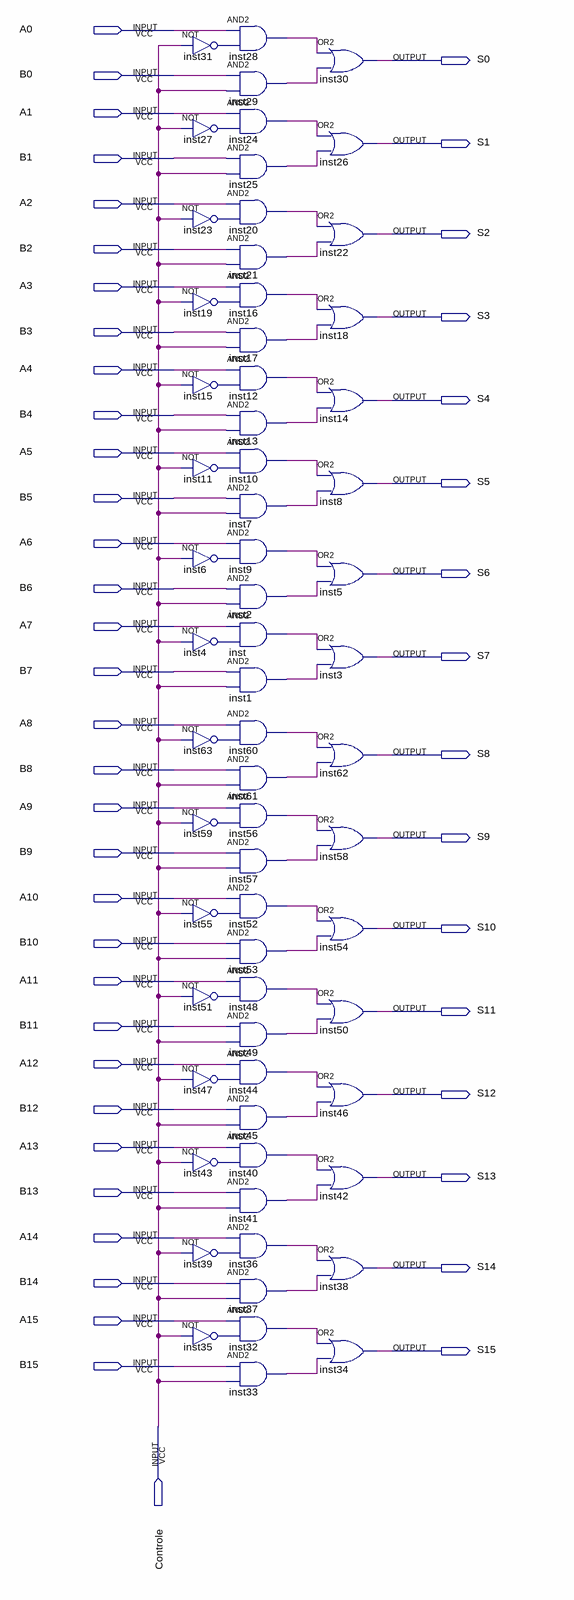
[diagram p0: schematic sheet]
// Quartus schematic Mux32X16.bdf as structural Verilog: 64 symbols, 49 pins
module Mux32X16 (
  input  A0,
  input  B0,
  input  A1,
  input  B1,
  input  A2,
  input  B2,
  input  A3,
  input  B3,
  input  A4,
  input  B4,
  input  A5,
  input  B5,
  input  A6,
  input  B6,
  input  A7,
  input  B7,
  input  A8,
  input  B8,
  input  A9,
  input  B9,
  input  A10,
  input  B10,
  input  A11,
  input  B11,
  input  A12,
  input  B12,
  input  A13,
  input  B13,
  input  A14,
  input  B14,
  input  A15,
  input  B15,
  input  Controle,
  output S0,
  output S1,
  output S2,
  output S3,
  output S4,
  output S5,
  output S6,
  output S7,
  output S8,
  output S9,
  output S10,
  output S11,
  output S12,
  output S13,
  output S14,
  output S15
);

  wire inst1_out, inst2_out, inst4_out, inst6_out, inst7_out, inst9_out, inst10_out, inst11_out, inst12_out,
       inst13_out, inst15_out, inst16_out, inst17_out, inst19_out, inst20_out, inst21_out, inst23_out,
       inst24_out, inst25_out, inst27_out, inst28_out, inst29_out, inst31_out, inst32_out, inst33_out,
       inst35_out, inst36_out, inst37_out, inst39_out, inst40_out, inst41_out, inst43_out, inst44_out,
       inst45_out, inst47_out, inst48_out, inst49_out, inst51_out, inst52_out, inst53_out, inst55_out,
       inst56_out, inst57_out, inst59_out, inst60_out, inst61_out, inst63_out, inst_out;

  not inst31 (inst31_out, Controle);
  not inst27 (inst27_out, Controle);
  not inst23 (inst23_out, Controle);
  not inst19 (inst19_out, Controle);
  not inst15 (inst15_out, Controle);
  not inst11 (inst11_out, Controle);
  not inst6 (inst6_out, Controle);
  not inst4 (inst4_out, Controle);
  not inst63 (inst63_out, Controle);
  not inst59 (inst59_out, Controle);
  not inst55 (inst55_out, Controle);
  not inst51 (inst51_out, Controle);
  not inst47 (inst47_out, Controle);
  not inst43 (inst43_out, Controle);
  not inst39 (inst39_out, Controle);
  not inst35 (inst35_out, Controle);
  and inst28 (inst28_out, A0, inst31_out);
  and inst29 (inst29_out, B0, Controle);
  and inst24 (inst24_out, A1, inst27_out);
  and inst25 (inst25_out, B1, Controle);
  and inst20 (inst20_out, A2, inst23_out);
  and inst21 (inst21_out, B2, Controle);
  and inst16 (inst16_out, A3, inst19_out);
  and inst17 (inst17_out, B3, Controle);
  and inst12 (inst12_out, A4, inst15_out);
  and inst13 (inst13_out, B4, Controle);
  and inst10 (inst10_out, A5, inst11_out);
  and inst7 (inst7_out, B5, Controle);
  and inst9 (inst9_out, A6, inst6_out);
  and inst2 (inst2_out, B6, Controle);
  and inst (inst_out, A7, inst4_out);
  and inst1 (inst1_out, B7, Controle);
  and inst60 (inst60_out, A8, inst63_out);
  and inst61 (inst61_out, B8, Controle);
  and inst56 (inst56_out, A9, inst59_out);
  and inst57 (inst57_out, B9, Controle);
  and inst52 (inst52_out, A10, inst55_out);
  and inst53 (inst53_out, B10, Controle);
  and inst48 (inst48_out, A11, inst51_out);
  and inst49 (inst49_out, B11, Controle);
  and inst44 (inst44_out, A12, inst47_out);
  and inst45 (inst45_out, B12, Controle);
  and inst40 (inst40_out, A13, inst43_out);
  and inst41 (inst41_out, B13, Controle);
  and inst36 (inst36_out, A14, inst39_out);
  and inst37 (inst37_out, B14, Controle);
  and inst32 (inst32_out, A15, inst35_out);
  and inst33 (inst33_out, B15, Controle);
  or inst30 (S0, inst28_out, inst29_out);
  or inst26 (S1, inst24_out, inst25_out);
  or inst22 (S2, inst20_out, inst21_out);
  or inst18 (S3, inst16_out, inst17_out);
  or inst14 (S4, inst12_out, inst13_out);
  or inst8 (S5, inst10_out, inst7_out);
  or inst5 (S6, inst9_out, inst2_out);
  or inst3 (S7, inst_out, inst1_out);
  or inst62 (S8, inst60_out, inst61_out);
  or inst58 (S9, inst56_out, inst57_out);
  or inst54 (S10, inst52_out, inst53_out);
  or inst50 (S11, inst48_out, inst49_out);
  or inst46 (S12, inst44_out, inst45_out);
  or inst42 (S13, inst40_out, inst41_out);
  or inst38 (S14, inst36_out, inst37_out);
  or inst34 (S15, inst32_out, inst33_out);
endmodule
